# EAGLE schematic Sensor_de_linha (EAGLE 8.3.1)
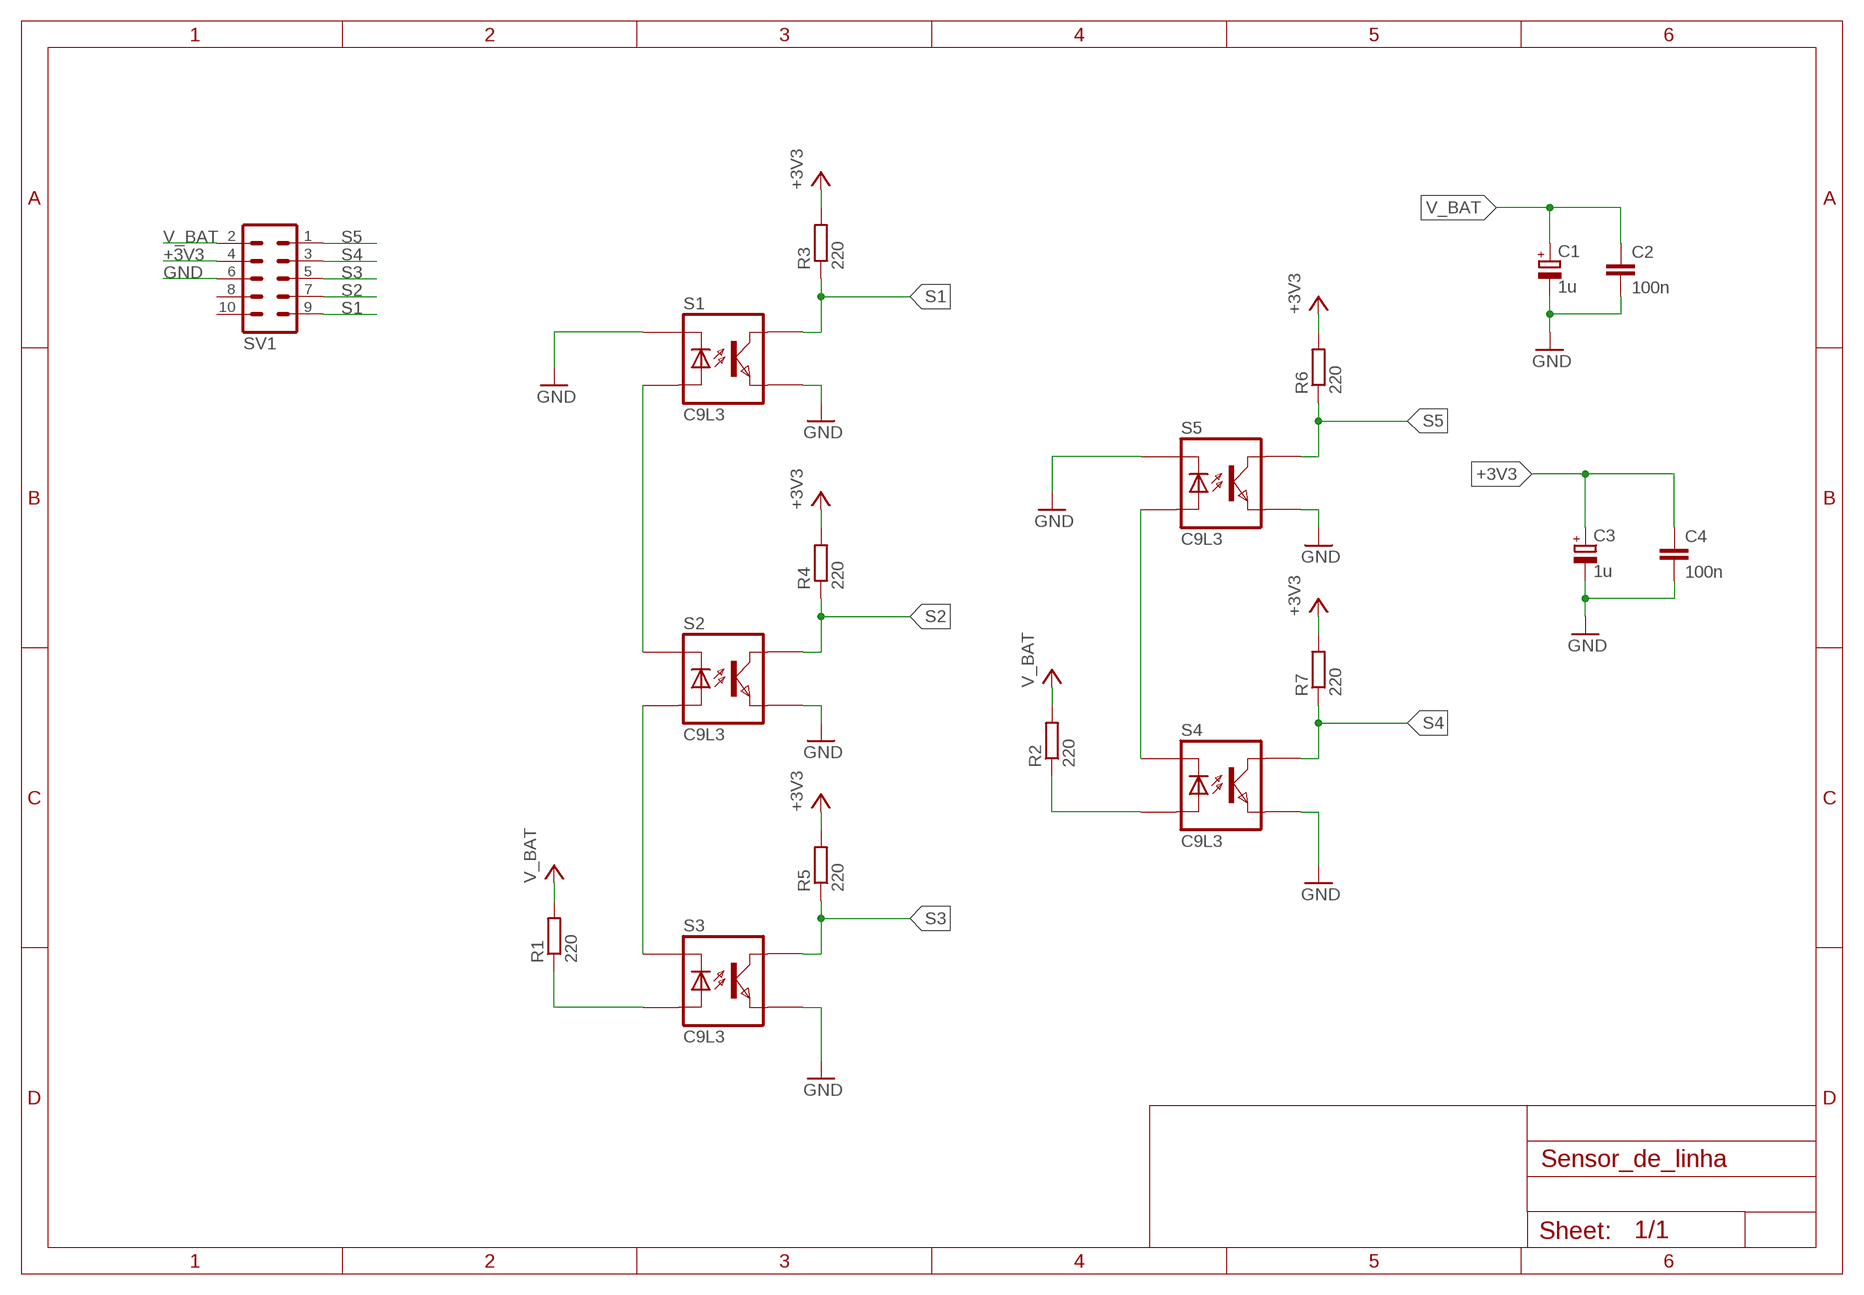
[diagram p0: schematic, sheet 1]

## Parts
C1  1u  CPOL-EUE5-5  [E5-5]
C2  100n  C-EU025-030X050  [C025-030X050]
C3  1u  CPOL-EUE5-5  [E5-5]
C4  100n  C-EU025-030X050  [C025-030X050]
R1  220  R-EU_0204/7  [0204/7]
R2  220  R-EU_0204/7  [0204/7]
R3  220  R-EU_0204/7  [0204/7]
R4  220  R-EU_0204/7  [0204/7]
R5  220  R-EU_0204/7  [0204/7]
R6  220  R-EU_0204/7  [0204/7]
R7  220  R-EU_0204/7  [0204/7]
S1  C9L3  [C9L3]
S2  C9L3  [C9L3]
S3  C9L3  [C9L3]
S4  C9L3  [C9L3]
S5  C9L3  [C9L3]
SV1  MA05-2  [MA05-2]

## Nets
+3V3: C3.+ C4.1 R3.2 R4.2 R5.2 R6.2 R7.2 SV1.4
GND [ground]: C1.- C2.2 C3.- C4.2 S1.2 S1.4 S2.2 S3.2 S4.2 S5.2 S5.4 SV1.6
N$1 [power]: R2.1 S4.1
N$2: S2.1 S3.4
N$3: S1.1 S2.4
N$4 [power]: R1.1 S3.1
N$5: S4.4 S5.1
S1: R3.1 S1.3 SV1.9
S2: R4.1 S2.3 SV1.7
S3: R5.1 S3.3 SV1.5
S4: R7.1 S4.3 SV1.3
S5: R6.1 S5.3 SV1.1
V_BAT [power]: C1.+ C2.1 R1.2 R2.2 SV1.2
Unconnected: SV1.8 SV1.10

## Library data of the parts
C1 C3 = rcl:CPOL-EU: POLARIZED CAPACITOR, European symbol
C2 C4 = rcl:C-EU: CAPACITOR, European symbol
R1-R7 = rcl:R-EU_: RESISTOR, European symbol
S1-S5 = 0_lucas:C9L3
SV1 = con-lstb:MA05-2: PIN HEADER; OC_FARNELL: unknown; OC_NEWARK: unknown

## Net classes
0 default: width 0.508 mm, drill 0.508 mm, clearance 0.508 mm
1 ground: width 0.508 mm, drill 0.508 mm, clearance 0.508 mm
2 power: width 0.508 mm, drill 0.508 mm, clearance 0.508 mm